# EAGLE design 06-eagleClass-555-board-route (EAGLE 7.6.0)
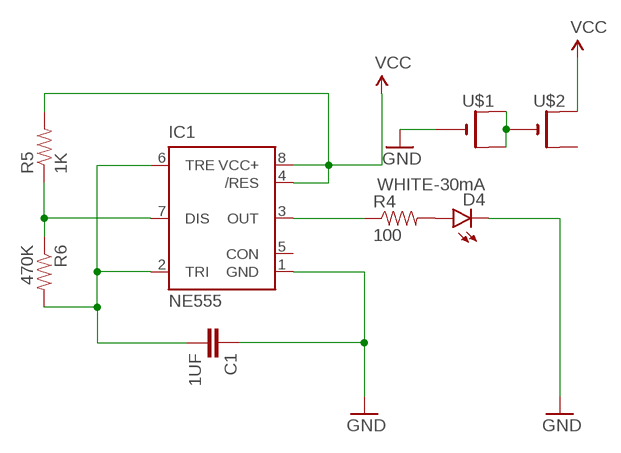
[diagram p0: schematic, sheet 1]

## Parts
C1  1UF  CAP_  [AXIAL-5MM]
D4  WHITE-30mA  LED5MM  [LED5MM]
IC1  NE555  [DIL-08]
R4  100  1KOHM-1/4W-5%(PTH)HORIZ-KIT  [AXIAL-0.3EZ]
R5  1K  1KOHM-1/4W-5%(PTH)HORIZ-KIT  [AXIAL-0.3EZ]
R6  470K  1KOHM-1/4W-5%(PTH)HORIZ-KIT  [AXIAL-0.3EZ]
U$1  CR2032THM  [CR2032-THRU]
U$2  CR2032THM  [CR2032-THRU]

## Nets
DISCHARGE: IC1.7(DIS) R5.P$1 R6.P$1
GND: C1.P$1 D4.K(C) IC1.1(GND) U$1.-
N$2: D4.A R4.P$2
N$3: IC1.2(TRI)
N$4: U$1.+1(+) U$1.+2(+1) U$2.-
OUT: IC1.3(OUT) R4.P$1
THRESHOLD: C1.P$2 IC1.6(TRE) R6.P$2
VCC: IC1.4(/RES) IC1.8(VCC+) R5.P$2 U$2.+1(+)
Unconnected: IC1.5(CON) U$2.+2(+1)

## Library data of the parts
C1 = SparkFun-Capacitors:CAP: Capacitor Standard 0603 ceramic capacitor, and 0.1" leaded capacitor.; PROD_ID: 445-8517-ND
D4 = SparkFun-LED:LED: LEDs Standard schematic elements and footprints for 5mm, 3mm, 1206, and 0603 sized LEDs. 5mm - Spark Fun Electronics SKU : COM-00529 (and others); PROD_ID: 67-2062-ND
IC1 = st-microelectronics:NE555: General purpose bipolar Timer; MF: Arrow Electronics; MPN: NE555N; OC_FARNELL: 1467742; OC_NEWARK: 89K1486; PROD_ID: 296-1857-5-ND
R4 R6 = SparkFun-Resistors:1KOHM-1/4W-5%(PTH): RES-08380; PROD_ID: RES-08380; VALUE: 1k
R5 = SparkFun-Resistors:1KOHM-1/4W-5%(PTH): RES-08380; PROD_ID: 1.0KQBK-ND; VALUE: 1k
U$1 U$2 = adafruit:CR2032

## Board
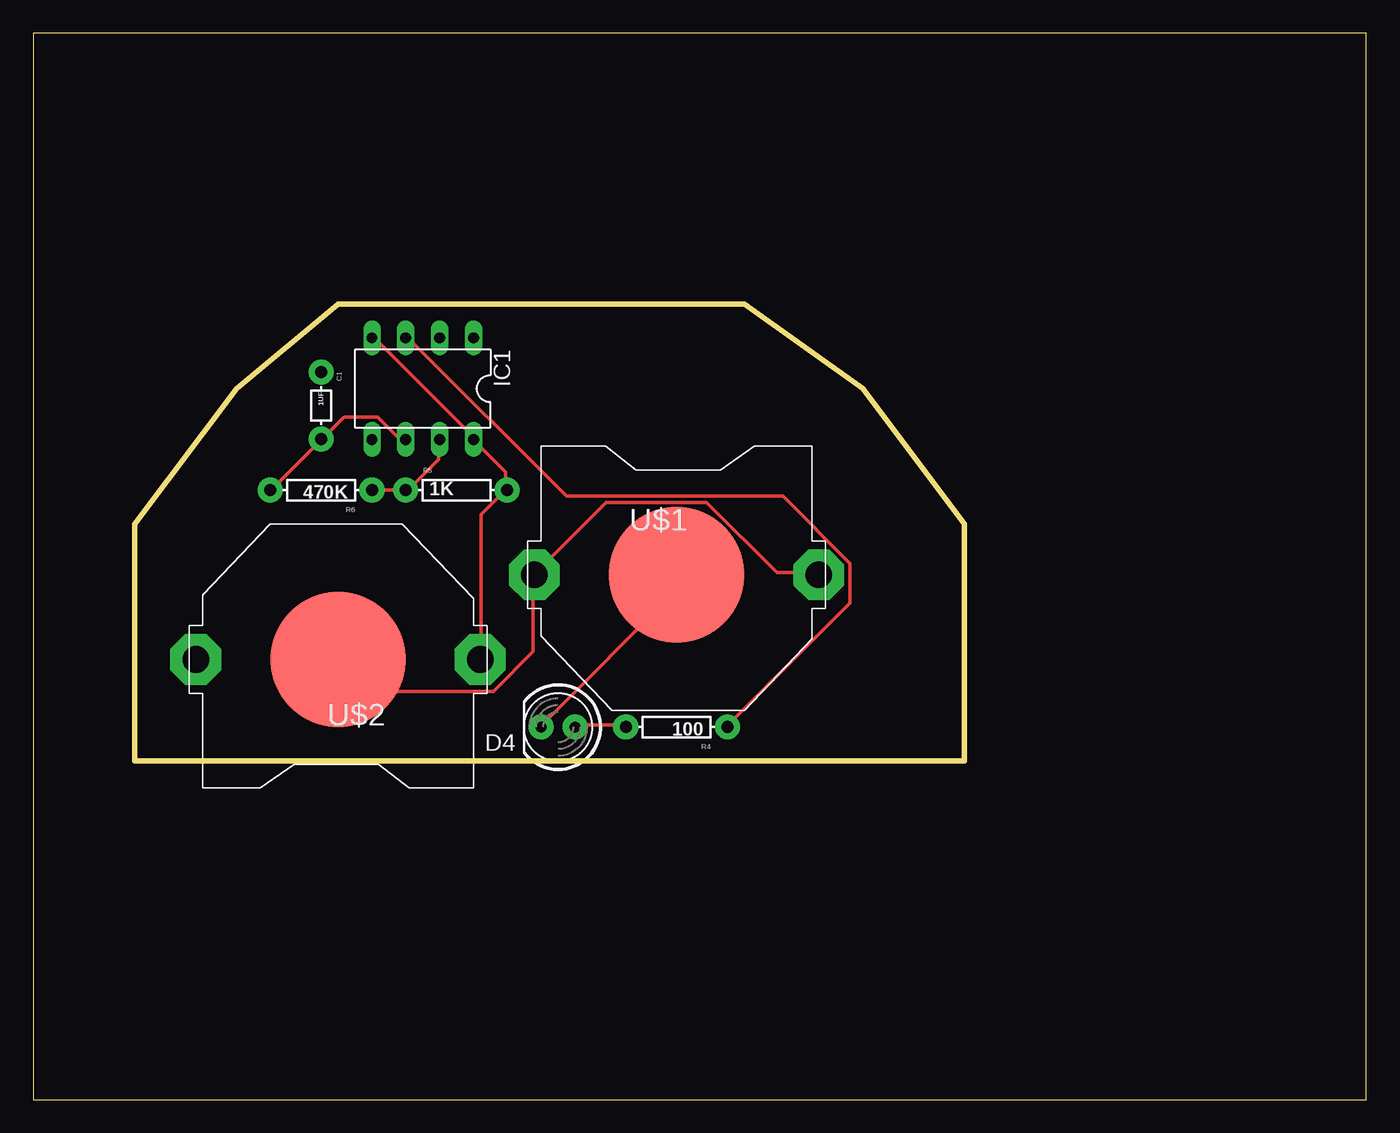
[diagram p1: board, top side]
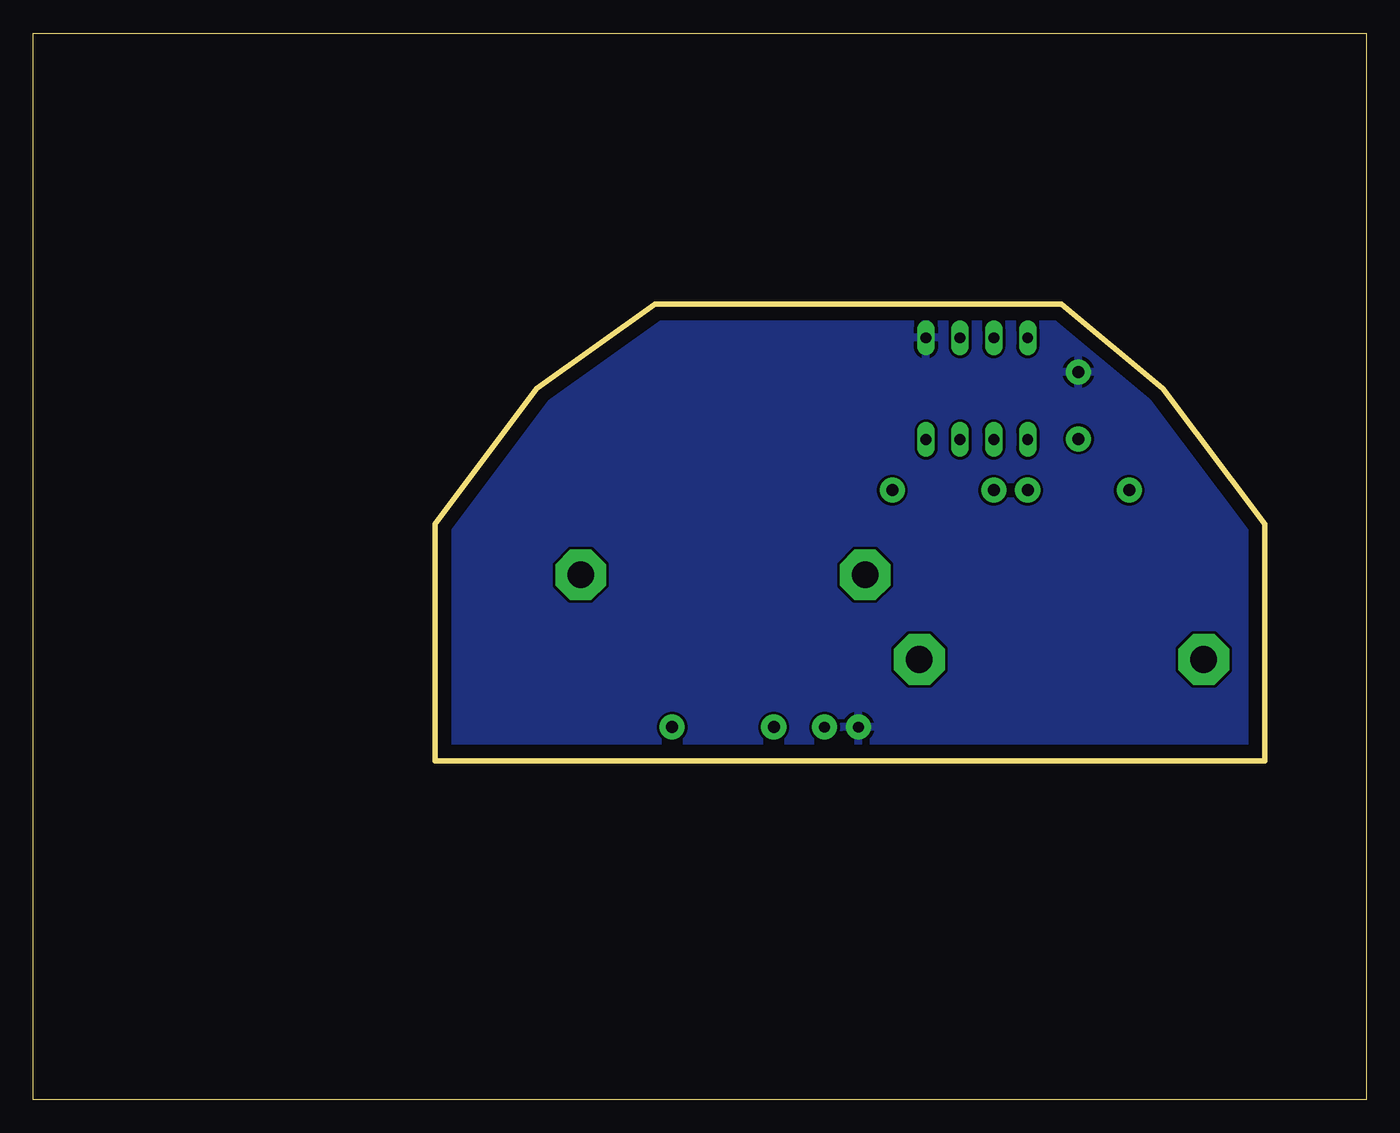
[diagram p2: board, bottom side, seen from below]

Size 100 x 80 mm. Coordinates in mm from the lower left corner, seen from the top.
Outline: 0,0 100,0 100,80 0,80 0,0
Outline: 7.62,25.4 7.62,43.18 15.24,53.34 22.86,59.69 53.34,59.69 62.23,53.34 69.85,43.18 69.85,25.4 7.62,25.4
Copper layers (1*16): Top 0.035mm / dielectric 1.5mm / Bottom 0.035mm
Design rules "default": minimum track width 10mil, minimum drill 24mil, track to track 8mil, track to pad 8mil, pad to pad 8mil, via to via 8mil, smd to smd 8mil, copper to edge 40mil, drill to drill 8mil, minimum pad ring 10mil, minimum via ring 8mil, stop-mask expansion 4mil, vias tented up to drill 0mil, thermal gap 10mil

### Footprints (pad centres in the part's own frame; a part is rotated, then mirrored left to right if it is on the bottom)
AXIAL-5MM = drill 0.9 pad 1.88: P$1 -2.5,0; P$2 2.5,0
LED5MM = drill 0.813 pad 1.88: A -1.27,0; K 1.27,0
DIL-08 = drill 0.813 long: 1 -3.81,-3.81; 2 -1.27,-3.81; 3 1.27,-3.81; 4 3.81,-3.81; 5 3.81,3.81; 6 1.27,3.81; 7 -1.27,3.81; 8 -3.81,3.81
AXIAL-0.3EZ = drill 0.9 pad 1.88: P$1 -3.81,0; P$2 3.81,0
CR2032-THRU = drill 2 pad 3.81 octagon: +1 -10.668,0; +2 10.668,0 | smd 10.16 x 10.16: - 0,0

### Placement (x,y rotation side)
C1  21.59,52.07 270 top
D4  39.37,27.94 180 top
IC1  29.21,53.34 180 top
R4  48.26,27.94 180 top
R5  31.75,45.72 0 top
R6  21.59,45.72 180 top
U$1  48.26,39.37 0 top
U$2  22.86,33.02 180 top

### Tracks (layer width: path | path; a pad name or v marks a point on that pad's centre or on a via)
DISCHARGE
  Top 0.254: IC1.7 30.4,49.38 30.4,48.01 28.12,45.72 R5.P$1 R6.P$1
GND
  Top 0.254: U$1.- 48.23,39.32 48.23,38.18 38.18,28.12 D4.K
  pour Bottom: 71.12,25.4 71.12,43.18 63.5,53.34 53.34,60.96 22.86,60.96 13.97,53.34 7.62,44.45 6.35,41.91 6.35,25.4 7.62,24.13 69.85,24.13
N$2
  Top 0.254: D4.A 40.69,28.12 44.35,28.12 R4.P$2
N$4
  Top 0.254: U$2.- 22.86,32.92 25.15,30.63 34.52,30.63 37.49,33.6 37.49,39.32 U$1.+1 37.72,39.55 42.98,44.81 50.52,44.81 55.78,39.55 58.75,39.55 U$1.+2
OUT
  Top 0.254: IC1.3 28.12,57.15 40.01,45.26 56.24,45.26 61.27,40.23 61.27,37.26 52.12,28.12 R4.P$1
THRESHOLD
  Top 0.254: IC1.6 27.89,49.61 27.43,49.61 25.83,51.21 23.32,51.21 21.72,49.61 C1.P$2 21.49,49.38 17.83,45.72 R6.P$2
VCC
  Top 0.254: IC1.4 25.6,57.15 33.15,49.61 IC1.8 33.15,49.38 35.43,47.09 35.43,45.72 | 35.43,45.72 33.6,43.89 33.6,33.15 U$2.+1 | 35.43,45.72 R5.P$2